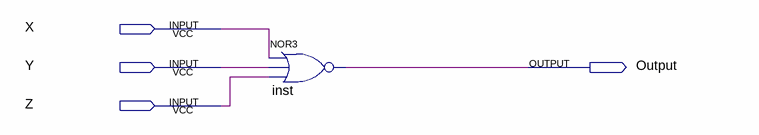
[diagram p0: schematic sheet]
// Quartus schematic Project.bdf as structural Verilog: 1 symbols, 4 pins
module Project (
  input  X,
  input  Y,
  input  Z,
  output Output
);

  nor inst (Output, X, Y, Z);
endmodule
